# Altium schematic sheet Accelerometer.SchDoc
size A
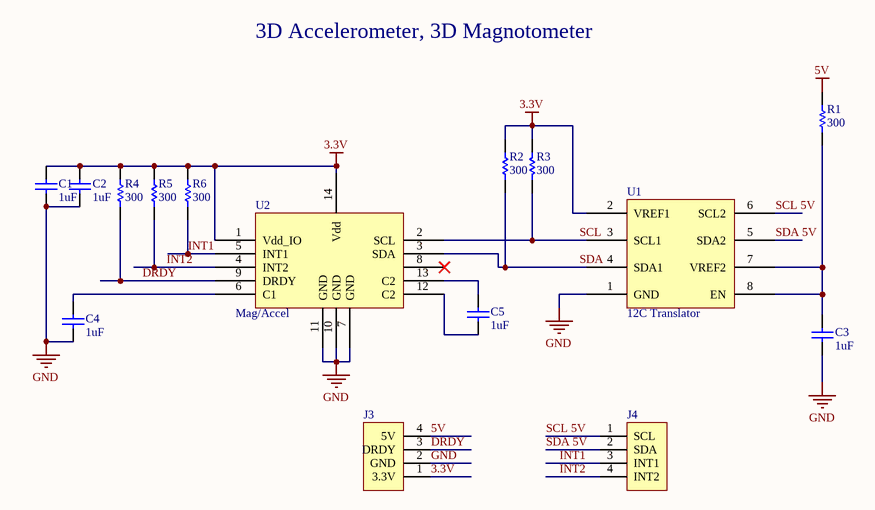
[diagram p0: Accelerometer.SchDoc]

## Parts
C1  value 1uF  [FTPNT_CAPS]  (hidden comment: Cap)
C2  value 1uF  [FTPNT_CAPS]  (hidden comment: Cap)
C3  value 1uF  [FTPNT_CAPS]  (hidden comment: Cap)
C4  value 1uF  [FTPNT_CAPS]  (hidden comment: Cap)
C5  value 1uF  [FTPNT_CAPS]  (hidden comment: Cap)
J3  Header 4  [HDR1X4]  (value not drawn)
J4  Header 4  [HDR1X4]  (value not drawn)
R1  value 300  [FTPNT_RESISTORS]  (hidden comment: Res1)
R2  value 300  [FTPNT_RESISTORS]  (hidden comment: Res1)
R3  value 300  [FTPNT_RESISTORS]  (hidden comment: Res1)
R4  value 300  [FTPNT_RESISTORS]  (hidden comment: Res1)
R5  value 300  [FTPNT_RESISTORS]  (hidden comment: Res1)
R6  value 300  [FTPNT_RESISTORS]  (hidden comment: Res1)
U1  12C Translator  [FTPNT_I2CTRANSLATOR]
U2  Mag/Accel  [FTPNT_MAG/ACC]

## Nets
3.3V: C1.2 C2.2 J3.1(3.3V) R2.2 R3.2 R4.2 R5.2 R6.2 U1.2(VREF1) U2.1(Vdd_IO) U2.14(Vdd)
5V: J3.4(5V) R1.2
GND: C1.1 C2.1 C3.1 C4.1 J3.2(GND) U1.1(GND) U2.7(GND) U2.10(GND) U2.11(GND)
DRDY: J3.3(DRDY) R4.1 U2.9(DRDY)
INT1: J4.3(INT1) R6.1 U2.5(INT1)
INT2: J4.4(INT2) R5.1 U2.4(INT2)
SCL: R3.1 U1.3(SCL1) U2.2(SCL)
SCL 5V: J4.1(SCL) U1.6(SCL2)
SDA: R2.1 U1.4(SDA1) U2.3(SDA)
SDA 5V: J4.2(SDA) U1.5(SDA2)
NetC3_2: C3.2 R1.1 U1.7(VREF2) U1.8(EN)
NetC4_2: C4.2 U2.6(C1)
NetC5_1: C5.1 U2.12(C2)
NetC5_2: C5.2 U2.13(C2)

Not connected (* = marked no-connect by the designer): U2 8*

## Notes on the sheet
- 3D Accelerometer, 3D Magnotometer

## Library data of the parts
C1-C5 = Cap: CAP CER 1UF 25V 10% X7R 1206; Published: 8-Jun-2000; LatestRevisionDate: 17-Jul-2002; LatestRevisionNote: Re-released for DXP Platform.; PackageReference: RAD-0.3; Publisher: Altium Limited; PackageDescription: 1206; Supplier 1: Digi-Key; Supplier Part Number 1: 445-1592-1-ND
J3 J4 = Header 4: CONN HEADER 4POS .100 STR TIN; LatestRevisionDate: 17-Jul-2002; LatestRevisionNote: Re-released for DXP Platform.; Publisher: Altium Limited; Supplier 1: Digi-Key; Supplier Part Number 1: A1972-ND; PackageDescription: SIP-4
R1-R6 = Res1: RES 300 OHM 1/4W 1% 1206 SMD; Published: 8-Jun-2000; LatestRevisionDate: 17-Jul-2002; LatestRevisionNote: Re-released for DXP Platform.; PackageReference: AXIAL-0.3; Publisher: Altium Limited; PackageDescription: 1206; Supplier 1: Digi-Key; Supplier Part Number 1: 311-300FRCT-ND
U1 = Translator: IC LEVEL TRANSLATOR 8-SOIC; Supplier 1: Digi-Key; Supplier Part Number 1: 568-4215-1-ND; PackageDescription: 8-SOIC
U2 = Mag/Accel Header: ACCELEROMETER/MAGNETOMETER LGA14; Supplier 1: Digi-Key; Supplier Part Number 1: 497-11918-1-ND; PackageDescription: LGA-14